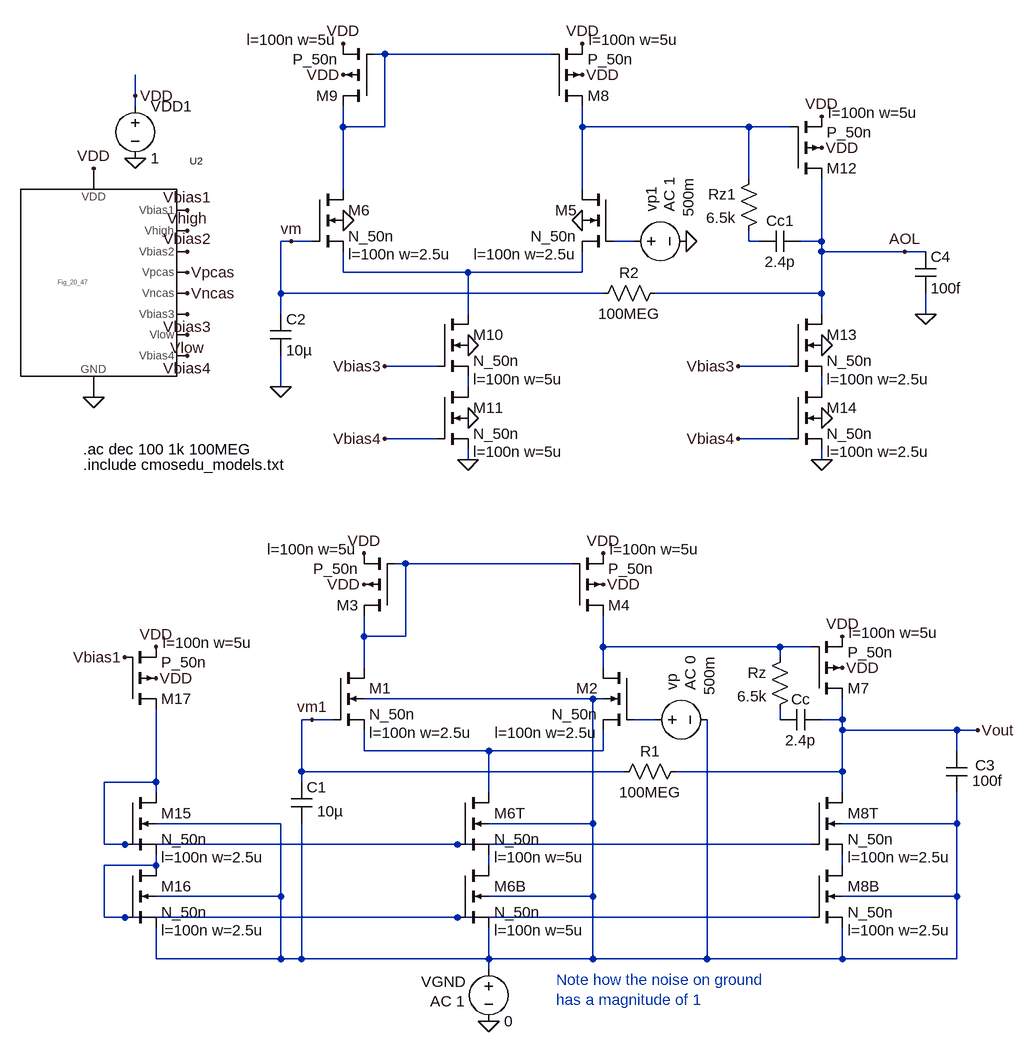
[diagram p0: schematic Fig24_27_PSRR_minus.asc]
Fig24_27_PSRR_minus.asc, the LTspice schematic file:
Version 4
SHEET 1 2536 680
WIRE 1232 -1600 1216 -1600
WIRE 1488 -1600 1232 -1600
WIRE 848 -1536 848 -1568
WIRE 848 -1520 848 -1536
WIRE 1168 -1488 1168 -1520
WIRE 1232 -1488 1232 -1600
WIRE 1232 -1488 1168 -1488
WIRE 1536 -1488 1536 -1520
WIRE 1792 -1488 1536 -1488
WIRE 1856 -1488 1792 -1488
WIRE 1792 -1408 1792 -1488
WIRE 1168 -1392 1168 -1488
WIRE 1536 -1392 1536 -1488
WIRE 1088 -1312 1072 -1312
WIRE 1120 -1312 1088 -1312
WIRE 1616 -1312 1584 -1312
WIRE 1792 -1312 1792 -1328
WIRE 1808 -1312 1792 -1312
WIRE 1904 -1312 1904 -1408
WIRE 1904 -1312 1872 -1312
WIRE 1904 -1296 1904 -1312
WIRE 2032 -1296 1904 -1296
WIRE 2064 -1296 2032 -1296
WIRE 1168 -1264 1168 -1296
WIRE 1360 -1264 1168 -1264
WIRE 1536 -1264 1536 -1296
WIRE 1536 -1264 1360 -1264
WIRE 1072 -1232 1072 -1312
WIRE 1568 -1232 1072 -1232
WIRE 1904 -1232 1904 -1296
WIRE 1904 -1232 1648 -1232
WIRE 1072 -1200 1072 -1232
WIRE 1360 -1200 1360 -1264
WIRE 1904 -1200 1904 -1232
WIRE 2064 -1200 2064 -1232
WIRE 1312 -1120 1232 -1120
WIRE 1856 -1120 1776 -1120
WIRE 1072 -1088 1072 -1136
WIRE 1360 -1088 1360 -1104
WIRE 1904 -1088 1904 -1104
WIRE 1312 -1008 1232 -1008
WIRE 1856 -1008 1776 -1008
WIRE 1360 -976 1360 -992
WIRE 1904 -976 1904 -992
WIRE 1264 -816 1248 -816
WIRE 1520 -816 1264 -816
WIRE 1200 -704 1200 -736
WIRE 1264 -704 1264 -816
WIRE 1264 -704 1200 -704
WIRE 1568 -688 1568 -736
WIRE 1840 -688 1568 -688
WIRE 1888 -688 1840 -688
WIRE 1840 -672 1840 -688
WIRE 1200 -656 1200 -704
WIRE 1568 -656 1568 -688
WIRE 1552 -608 1200 -608
WIRE 1568 -608 1552 -608
WIRE 1120 -576 1104 -576
WIRE 1152 -576 1120 -576
WIRE 1648 -576 1616 -576
WIRE 1840 -576 1840 -592
WIRE 1936 -576 1936 -608
WIRE 1936 -576 1904 -576
WIRE 1936 -560 1936 -576
WIRE 2112 -560 1936 -560
WIRE 2144 -560 2112 -560
WIRE 1200 -528 1200 -560
WIRE 1392 -528 1200 -528
WIRE 1568 -528 1568 -560
WIRE 1568 -528 1392 -528
WIRE 2112 -528 2112 -560
WIRE 1104 -496 1104 -576
WIRE 1600 -496 1104 -496
WIRE 1936 -496 1936 -560
WIRE 1936 -496 1680 -496
WIRE 880 -480 880 -592
WIRE 880 -480 800 -480
WIRE 1104 -480 1104 -496
WIRE 880 -464 880 -480
WIRE 1392 -464 1392 -528
WIRE 1936 -464 1936 -496
WIRE 1072 -416 880 -416
WIRE 1552 -416 1552 -608
WIRE 1552 -416 1392 -416
WIRE 2112 -416 2112 -464
WIRE 2112 -416 1936 -416
WIRE 800 -384 800 -480
WIRE 832 -384 800 -384
WIRE 1344 -384 832 -384
WIRE 1888 -384 1344 -384
WIRE 880 -352 880 -368
WIRE 880 -352 800 -352
WIRE 1392 -352 1392 -368
WIRE 1936 -352 1936 -368
WIRE 1072 -304 1072 -416
WIRE 1072 -304 880 -304
WIRE 1552 -304 1552 -416
WIRE 1552 -304 1392 -304
WIRE 2112 -304 2112 -416
WIRE 2112 -304 1936 -304
WIRE 800 -272 800 -352
WIRE 832 -272 800 -272
WIRE 1344 -272 832 -272
WIRE 1888 -272 1344 -272
WIRE 880 -208 880 -256
WIRE 1072 -208 1072 -304
WIRE 1072 -208 880 -208
WIRE 1104 -208 1104 -416
WIRE 1104 -208 1072 -208
WIRE 1392 -208 1392 -256
WIRE 1392 -208 1104 -208
WIRE 1552 -208 1552 -304
WIRE 1552 -208 1392 -208
WIRE 1728 -208 1728 -576
WIRE 1728 -208 1552 -208
WIRE 1936 -208 1936 -256
WIRE 1936 -208 1728 -208
WIRE 2112 -208 2112 -304
WIRE 2112 -208 1936 -208
WIRE 1392 -192 1392 -208
FLAG 1568 -832 VDD
FLAG 1568 -784 VDD
FLAG 1200 -784 VDD
FLAG 1200 -832 VDD
FLAG 1120 -576 vm1
FLAG 1936 -704 VDD
FLAG 1936 -656 VDD
FLAG 2144 -560 Vout
FLAG 1392 -112 0
FLAG 848 -1440 0
FLAG 848 -1536 VDD
FLAG 1536 -1344 0
FLAG 1360 -976 0
FLAG 1168 -1344 0
FLAG 1536 -1616 VDD
FLAG 1536 -1568 VDD
FLAG 1168 -1568 VDD
FLAG 784 -1424 VDD
FLAG 784 -1072 0
FLAG 928 -1360 Vbias1
FLAG 928 -1328 Vhigh
FLAG 928 -1296 Vbias2
FLAG 928 -1200 Vbias3
FLAG 928 -1264 Vpcas
FLAG 928 -1232 Vncas
FLAG 928 -1136 Vbias4
FLAG 928 -1168 Vlow
FLAG 1168 -1616 VDD
FLAG 1360 -1152 0
FLAG 1360 -1040 0
FLAG 1232 -1120 Vbias3
FLAG 1232 -1008 Vbias4
FLAG 1696 -1312 0
FLAG 1088 -1312 vm
FLAG 1904 -1504 VDD
FLAG 1904 -1456 VDD
FLAG 1904 -976 0
FLAG 1904 -1152 0
FLAG 1904 -1040 0
FLAG 1776 -1120 Vbias3
FLAG 1776 -1008 Vbias4
FLAG 2032 -1296 AOL
FLAG 1072 -1088 0
FLAG 2064 -1200 0
FLAG 880 -688 VDD
FLAG 880 -640 VDD
FLAG 832 -672 Vbias1
SYMBOL nmos4 1616 -656 M0
WINDOW 123 56 100 Left 2
SYMATTR Value2 l=100n w=2.5u
SYMATTR InstName M2
SYMATTR Value N_50n
SYMBOL nmos4 1152 -656 R0
WINDOW 123 56 100 Left 2
SYMATTR Value2 l=100n w=2.5u
SYMATTR InstName M1
SYMATTR Value N_50n
SYMBOL pmos4 1520 -736 M180
WINDOW 123 58 102 Left 2
WINDOW 0 56 16 Left 2
SYMATTR Value2 l=100n w=5u
SYMATTR InstName M4
SYMATTR Value P_50n
SYMBOL pmos4 1248 -736 R180
WINDOW 123 58 102 Left 2
WINDOW 0 56 16 Left 2
SYMATTR Value2 l=100n w=5u
SYMATTR InstName M3
SYMATTR Value P_50n
SYMBOL nmos4 1344 -464 R0
WINDOW 123 56 100 Left 2
SYMATTR Value2 l=100n w=5u
SYMATTR InstName M6T
SYMATTR Value N_50n
SYMBOL nmos4 1344 -352 R0
WINDOW 123 56 100 Left 2
SYMATTR Value2 l=100n w=5u
SYMATTR InstName M6B
SYMATTR Value N_50n
SYMBOL voltage 1632 -576 R270
WINDOW 0 45 42 Left 2
WINDOW 3 37 99 Left 2
WINDOW 123 45 70 Left 2
WINDOW 39 0 0 Left 2
SYMATTR InstName vp
SYMATTR Value 500m
SYMATTR Value2 AC 0
SYMBOL pmos4 1888 -608 M180
WINDOW 123 58 102 Left 2
WINDOW 0 56 16 Left 2
SYMATTR Value2 l=100n w=5u
SYMATTR InstName M7
SYMATTR Value P_50n
SYMBOL nmos4 1888 -464 R0
WINDOW 123 56 100 Left 2
SYMATTR Value2 l=100n w=2.5u
SYMATTR InstName M8T
SYMATTR Value N_50n
SYMBOL nmos4 1888 -352 R0
WINDOW 123 56 100 Left 2
SYMATTR Value2 l=100n w=2.5u
SYMATTR InstName M8B
SYMATTR Value N_50n
SYMBOL cap 1088 -480 R0
WINDOW 3 40 45 Left 2
SYMATTR Value 10µ
SYMATTR InstName C1
SYMBOL res 1584 -480 R270
WINDOW 0 32 56 VTop 2
WINDOW 3 0 56 VBottom 2
SYMATTR InstName R1
SYMATTR Value 100MEG
SYMBOL cap 1904 -592 R90
WINDOW 0 0 32 VBottom 2
WINDOW 3 32 32 VTop 2
SYMATTR InstName Cc
SYMATTR Value 2.4p
SYMBOL cap 2096 -528 R0
WINDOW 0 44 22 Left 2
WINDOW 3 40 46 Left 2
SYMATTR InstName C3
SYMATTR Value 100f
SYMBOL res 1856 -688 M0
SYMATTR InstName Rz
SYMATTR Value 6.5k
SYMBOL voltage 1392 -208 R0
WINDOW 123 -90 65 Left 2
WINDOW 39 0 0 Left 2
WINDOW 0 -104 35 Left 2
SYMATTR Value2 AC 1
SYMATTR InstName VGND
SYMATTR Value 0
SYMBOL voltage 848 -1536 R0
WINDOW 123 0 0 Left 2
WINDOW 39 0 0 Left 2
SYMATTR InstName VDD1
SYMATTR Value 1
SYMBOL nmos4 1584 -1392 M0
WINDOW 123 56 100 Left 2
SYMATTR Value2 l=100n w=2.5u
SYMATTR InstName M5
SYMATTR Value N_50n
SYMBOL nmos4 1120 -1392 R0
WINDOW 123 56 100 Left 2
SYMATTR Value2 l=100n w=2.5u
SYMATTR InstName M6
SYMATTR Value N_50n
SYMBOL pmos4 1488 -1520 M180
WINDOW 123 58 102 Left 2
WINDOW 0 56 16 Left 2
SYMATTR Value2 l=100n w=5u
SYMATTR InstName M8
SYMATTR Value P_50n
SYMBOL pmos4 1216 -1520 R180
WINDOW 123 58 102 Left 2
WINDOW 0 56 16 Left 2
SYMATTR Value2 l=100n w=5u
SYMATTR InstName M9
SYMATTR Value P_50n
SYMBOL Fig_20_47 784 -1248 R0
SYMATTR InstName U2
SYMBOL nmos4 1312 -1200 R0
WINDOW 123 56 100 Left 2
SYMATTR Value2 l=100n w=5u
SYMATTR InstName M10
SYMATTR Value N_50n
SYMBOL nmos4 1312 -1088 R0
WINDOW 123 56 100 Left 2
SYMATTR Value2 l=100n w=5u
SYMATTR InstName M11
SYMATTR Value N_50n
SYMBOL voltage 1600 -1312 R270
WINDOW 0 45 42 Left 2
WINDOW 3 37 99 Left 2
WINDOW 123 45 70 Left 2
WINDOW 39 0 0 Left 2
SYMATTR InstName vp1
SYMATTR Value 500m
SYMATTR Value2 AC 1
SYMBOL pmos4 1856 -1408 M180
WINDOW 123 58 102 Left 2
WINDOW 0 56 16 Left 2
SYMATTR Value2 l=100n w=5u
SYMATTR InstName M12
SYMATTR Value P_50n
SYMBOL nmos4 1856 -1200 R0
WINDOW 123 56 100 Left 2
SYMATTR Value2 l=100n w=2.5u
SYMATTR InstName M13
SYMATTR Value N_50n
SYMBOL nmos4 1856 -1088 R0
WINDOW 123 56 100 Left 2
SYMATTR Value2 l=100n w=2.5u
SYMATTR InstName M14
SYMATTR Value N_50n
SYMBOL cap 1056 -1200 R0
SYMATTR InstName C2
SYMATTR Value 10µ
SYMBOL res 1552 -1216 R270
WINDOW 0 32 56 VTop 2
WINDOW 3 0 56 VBottom 2
SYMATTR InstName R2
SYMATTR Value 100MEG
SYMBOL cap 1872 -1328 R90
WINDOW 0 0 32 VBottom 2
WINDOW 3 32 32 VTop 2
SYMATTR InstName Cc1
SYMATTR Value 2.4p
SYMBOL cap 2048 -1296 R0
SYMATTR InstName C4
SYMATTR Value 100f
SYMBOL res 1808 -1424 M0
SYMATTR InstName Rz1
SYMATTR Value 6.5k
SYMBOL nmos4 832 -464 R0
WINDOW 123 56 100 Left 2
SYMATTR Value2 l=100n w=2.5u
SYMATTR InstName M15
SYMATTR Value N_50n
SYMBOL nmos4 832 -352 R0
WINDOW 123 56 100 Left 2
SYMATTR Value2 l=100n w=2.5u
SYMATTR InstName M16
SYMATTR Value N_50n
SYMBOL pmos4 832 -592 M180
WINDOW 123 58 102 Left 2
WINDOW 0 56 16 Left 2
SYMATTR Value2 l=100n w=5u
SYMATTR InstName M17
SYMATTR Value P_50n
TEXT 1496 -176 Left 2 ;Note how the noise on ground\nhas a magnitude of 1
TEXT 768 -968 Left 2 !.include cmosedu_models.txt
TEXT 768 -992 Left 2 !.ac dec 100 1k 100MEG

The netlist it stands for:
* Fig24_27_PSRR_minus.asc
M2 N009 N011 N013 N010 N_50n l=100n w=2.5u
M1 N008 vm1 N013 N010 N_50n l=100n w=2.5u
M4 N009 N008 VDD VDD P_50n l=100n w=5u
M3 N008 N008 VDD VDD P_50n l=100n w=5u
M6T N013 N014 N016 N010 N_50n l=100n w=5u
M6B N016 N015 N010 N010 N_50n l=100n w=5u
vp N011 N010 500m AC 0
M7 Vout N009 VDD VDD P_50n l=100n w=5u
M8T Vout N014 N017 N010 N_50n l=100n w=2.5u
M8B N017 N015 N010 N010 N_50n l=100n w=2.5u
C1 vm1 N010 10µ
R1 vm1 Vout 100MEG
Cc Vout N012 2.4p
C3 Vout N010 100f
Rz N009 N012 6.5k
VGND N010 0 0 AC 1
VDD1 VDD 0 1
M5 N002 N003 N005 0 N_50n l=100n w=2.5u
M6 N001 vm N005 0 N_50n l=100n w=2.5u
M8 N002 N001 VDD VDD P_50n l=100n w=5u
M9 N001 N001 VDD VDD P_50n l=100n w=5u
XU2 Vbias1 Vhigh Vbias2 Vpcas Vncas Vbias3 Vlow Vbias4 VDD 0 Fig_20_47  ; pins Vbias1 Vhigh Vbias2 Vpcas Vncas Vbias3 Vlow Vbias4 VDD GND
M10 N005 Vbias3 N006 0 N_50n l=100n w=5u
M11 N006 Vbias4 0 0 N_50n l=100n w=5u
vp1 N003 0 500m AC 1
M12 AOL N002 VDD VDD P_50n l=100n w=5u
M13 AOL Vbias3 N007 0 N_50n l=100n w=2.5u
M14 N007 Vbias4 0 0 N_50n l=100n w=2.5u
C2 vm 0 10µ
R2 vm AOL 100MEG
Cc1 AOL N004 2.4p
C4 AOL 0 100f
Rz1 N002 N004 6.5k
M15 N014 N014 N015 N010 N_50n l=100n w=2.5u
M16 N015 N015 N010 N010 N_50n l=100n w=2.5u
M17 N014 Vbias1 VDD VDD P_50n l=100n w=5u
.model NMOS NMOS
.model PMOS PMOS
.lib standard.mos
* Note how the noise on ground
* has a magnitude of 1
.include cmosedu_models.txt
.ac dec 100 1k 100MEG
.backanno
.end